# Altium schematic sheet ICE40.SchDoc
size A
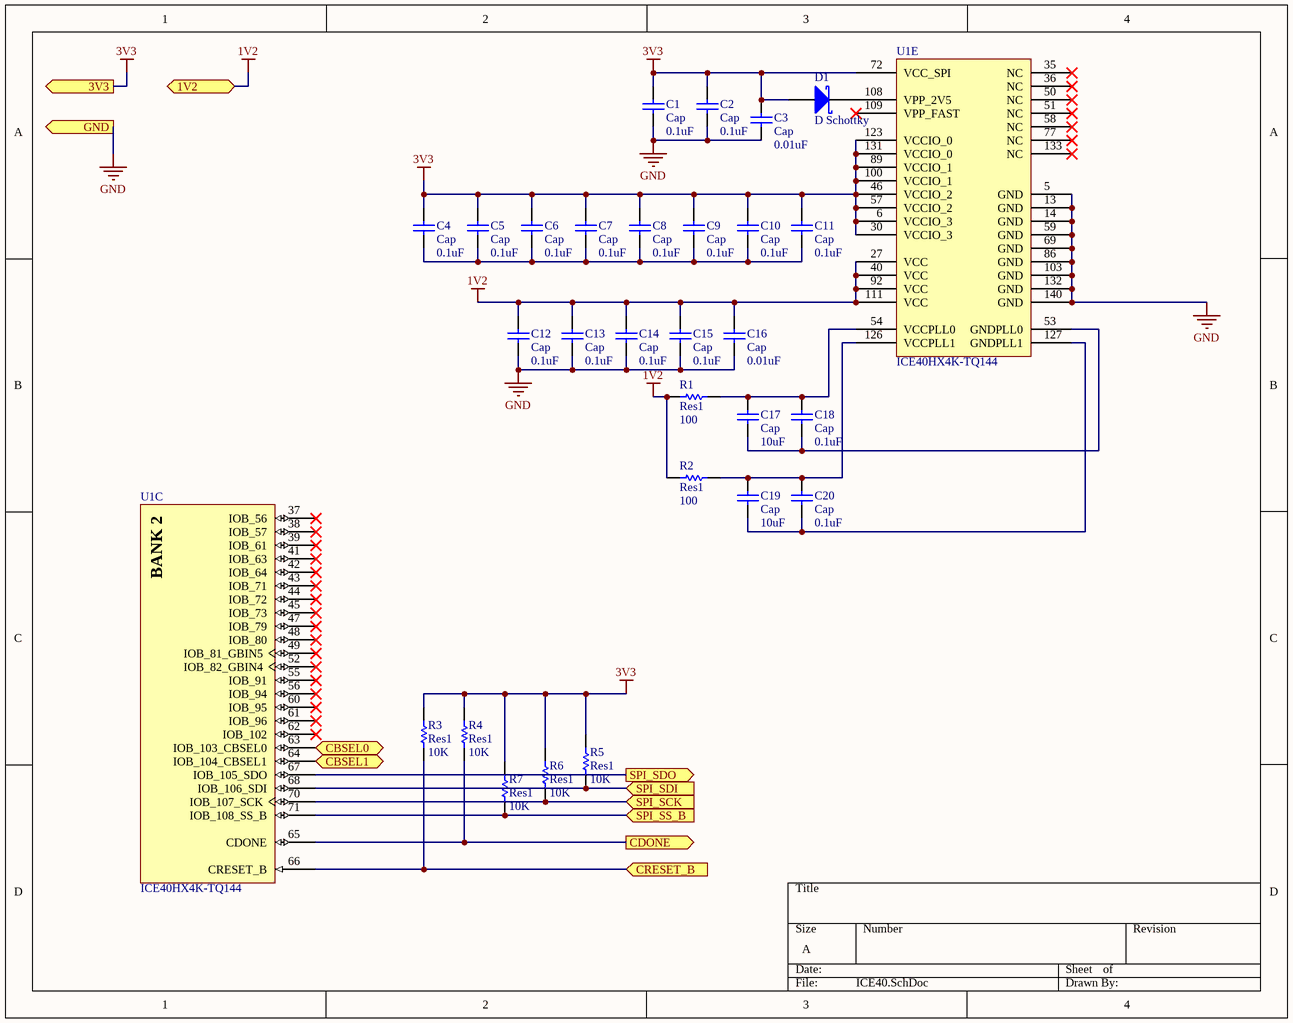
[diagram p0: ICE40.SchDoc]

## Parts
C1  Cap  value 0.1uF  [RAD-0.3]
C2  Cap  value 0.1uF  [RAD-0.3]
C3  Cap  value 0.01uF  [RAD-0.3]
C4  Cap  value 0.1uF  [RAD-0.3]
C5  Cap  value 0.1uF  [RAD-0.3]
C6  Cap  value 0.1uF  [RAD-0.3]
C7  Cap  value 0.1uF  [RAD-0.3]
C8  Cap  value 0.1uF  [RAD-0.3]
C9  Cap  value 0.1uF  [RAD-0.3]
C10  Cap  value 0.1uF  [RAD-0.3]
C11  Cap  value 0.1uF  [RAD-0.3]
C12  Cap  value 0.1uF  [RAD-0.3]
C13  Cap  value 0.1uF  [RAD-0.3]
C14  Cap  value 0.1uF  [RAD-0.3]
C15  Cap  value 0.1uF  [RAD-0.3]
C16  Cap  value 0.01uF  [RAD-0.3]
C17  Cap  value 10uF  [RAD-0.3]
C18  Cap  value 0.1uF  [RAD-0.3]
C19  Cap  value 10uF  [RAD-0.3]
C20  Cap  value 0.1uF  [RAD-0.3]
D1  D Schottky  [SMB]
R1  Res1  value 100  [AXIAL-0.3]
R2  Res1  value 100  [AXIAL-0.3]
R3  Res1  value 10K  [AXIAL-0.3]
R4  Res1  value 10K  [AXIAL-0.3]
R5  Res1  value 10K  [AXIAL-0.3]
R6  Res1  value 10K  [AXIAL-0.3]
R7  Res1  value 10K  [AXIAL-0.3]
U1  ICE40HX4K-TQ144  [LATC-TQFP-144_M]  (parts C,E of 5)

## Ports
1V2, 3V3, CBSEL0 (bidir), CBSEL1 (bidir), CDONE (out), CRESET_B (in), GND, SPI_SCK (in), SPI_SDI (in), SPI_SDO (out), SPI_SS_B (in)

## Nets
1V2: C12.1 C13.1 C14.1 C15.1 C16.1 R1.1 R2.1 U1.27(VCC) U1.40(VCC) U1.92(VCC) U1.111(VCC) ; port 1V2
3V3: C1.1 C2.1 C3.1 C4.1 C5.1 C6.1 C7.1 C8.1 C9.1 C10.1 C11.1 D1.1(A) R3.2 R4.2 R5.2 R6.2 R7.2 U1.6(VCCIO_3) U1.30(VCCIO_3) U1.46(VCCIO_2) U1.57(VCCIO_2) U1.72(VCC_SPI) U1.89(VCCIO_1) U1.100(VCCIO_1) U1.123(VCCIO_0) U1.131(VCCIO_0) ; port 3V3
GND: C1.2 C2.2 C3.2 C12.2 C13.2 C14.2 C15.2 C16.2 U1.5(GND) U1.13(GND) U1.14(GND) U1.59(GND) U1.69(GND) U1.86(GND) U1.103(GND) U1.132(GND) U1.140(GND) ; port GND
CBSEL0: U1.63(IOB_103_CBSEL0) ; port CBSEL0
CBSEL1: U1.64(IOB_104_CBSEL1) ; port CBSEL1
CDONE: R4.1 U1.65(CDONE) ; port CDONE
CRESET_B: R3.1 U1.66(CRESET_B) ; port CRESET_B
SPI_SCK: R6.1 U1.70(IOB_107_SCK) ; port SPI_SCK
SPI_SDI: R5.1 U1.68(IOB_106_SDI) ; port SPI_SDI
SPI_SDO: U1.67(IOB_105_SDO) ; port SPI_SDO
SPI_SS_B: R7.1 U1.71(IOB_108_SS_B) ; port SPI_SS_B
NetC4_2: C4.2 C5.2 C6.2 C7.2 C8.2 C9.2 C10.2 C11.2
NetC17_1: C17.1 C18.1 R1.2 U1.54(VCCPLL0)
NetC17_2: C17.2 C18.2 U1.53(GNDPLL0)
NetC19_1: C19.1 C20.1 R2.2 U1.126(VCCPLL1)
NetC19_2: C19.2 C20.2 U1.127(GNDPLL1)
NetD1_2: D1.2(K) U1.108(VPP_2V5)

Not connected (* = marked no-connect by the designer): U1 35(NC)* 36(NC)* 37(IOB_56)* 38(IOB_57)* 39(IOB_61)* 41(IOB_63)* 42(IOB_64)* 43(IOB_71)* 44(IOB_72)* 45(IOB_73)* 47(IOB_79)* 48(IOB_80)* 49(IOB_81_GBIN5)* 50(NC)* 51(NC)* 52(IOB_82_GBIN4)* 55(IOB_91)* 56(IOB_94)* 58(NC)* 60(IOB_95)* 61(IOB_96)* 62(IOB_102)* 77(NC)* 109(VPP_FAST)* 133(NC)*

## Notes on the sheet
- (in symbol ICE40HX4K-TQ144, part C) BANK 2

## Library data of the parts
C1-C20 = Cap: Capacitor; Published: 8-Jun-2000; LatestRevisionDate: 17-Jul-2002; LatestRevisionNote: Re-released for DXP Platform.; PackageReference: RAD-0.3; Publisher: Altium Limited; PackageDescription: Radial Cap, Thru-Hole; 2 Leads; 0.3 in Pin Spacing
D1 = D Schottky: Schottky Diode; Published: 8-Jun-2000; LatestRevisionDate: 17-Jul-2002; LatestRevisionNote: Re-released for DXP Platform.; PackageReference: SMB; Publisher: Altium Limited; PackageDescription: DO-214-AA/SMB; 2 C-Bend Leads; Body 5.3 x 3.6 mm, inc. leads (LxW); Code_JEDEC: DO-214-AA
R1-R7 = Res1: Resistor; Published: 8-Jun-2000; LatestRevisionDate: 17-Jul-2002; LatestRevisionNote: Re-released for DXP Platform.; PackageReference: AXIAL-0.3; Publisher: Altium Limited; PackageDescription: Axial Device, Thru-Hole; 2 Leads; 0.3 in Pin Spacing
U1 = ICE40HX4K-TQ144: iCE40 HX4K Series FPGA Family, 3520 Logic Cells, 1.2 V Core, 80 K Embedded RAM Bits, 144-pin TQFP, Pb-Free, Tray; Manufacturer: Lattice Semiconductor; Embedded RAM Bits: 80K; Logic Cells: 3520; Phase-Locked Loops: 2; Supply Voltage: 1.2V; DatasheetVersion: Rev. 02.9; PackageVersion: Rev. 03.9, 02/2013; PackageReference: TQFP-144; PackageDescription: 144-Pin Thin Quad Flat Package, Body 20 x 20 mm, Pitch 0.5 mm; Supplier 1: Digi-Key; Supplier Part Number 1: 220-1572-ND; Supplier 2: Mouser; Supplier Part Number 2: 842-ICE40HX4K-TQ144; Packing: Tray; RoHS: TRUE; Mounting Technology: Surface Mount; PartNumber: ICE40HX4K-TQ144; ComponentLink1Description: Manufacturer URL; ComponentLink1URL: http://www.latticesemi.com/en; ComponentLink2Description: Datasheet; ComponentLink2URL: http://www.latticesemi.com/~/media/Documents/DataSheets/iCE/iCE40LPHXFamilyDataSheet.pdf; ComponentLink3Description: Package Specification; ComponentLink3URL: http://www.latticesemi.com/lit/docs/package/pkg.pdf